# EAGLE design DeadOn RTC - DS3234 Breakout-v11 (EAGLE 6.4)
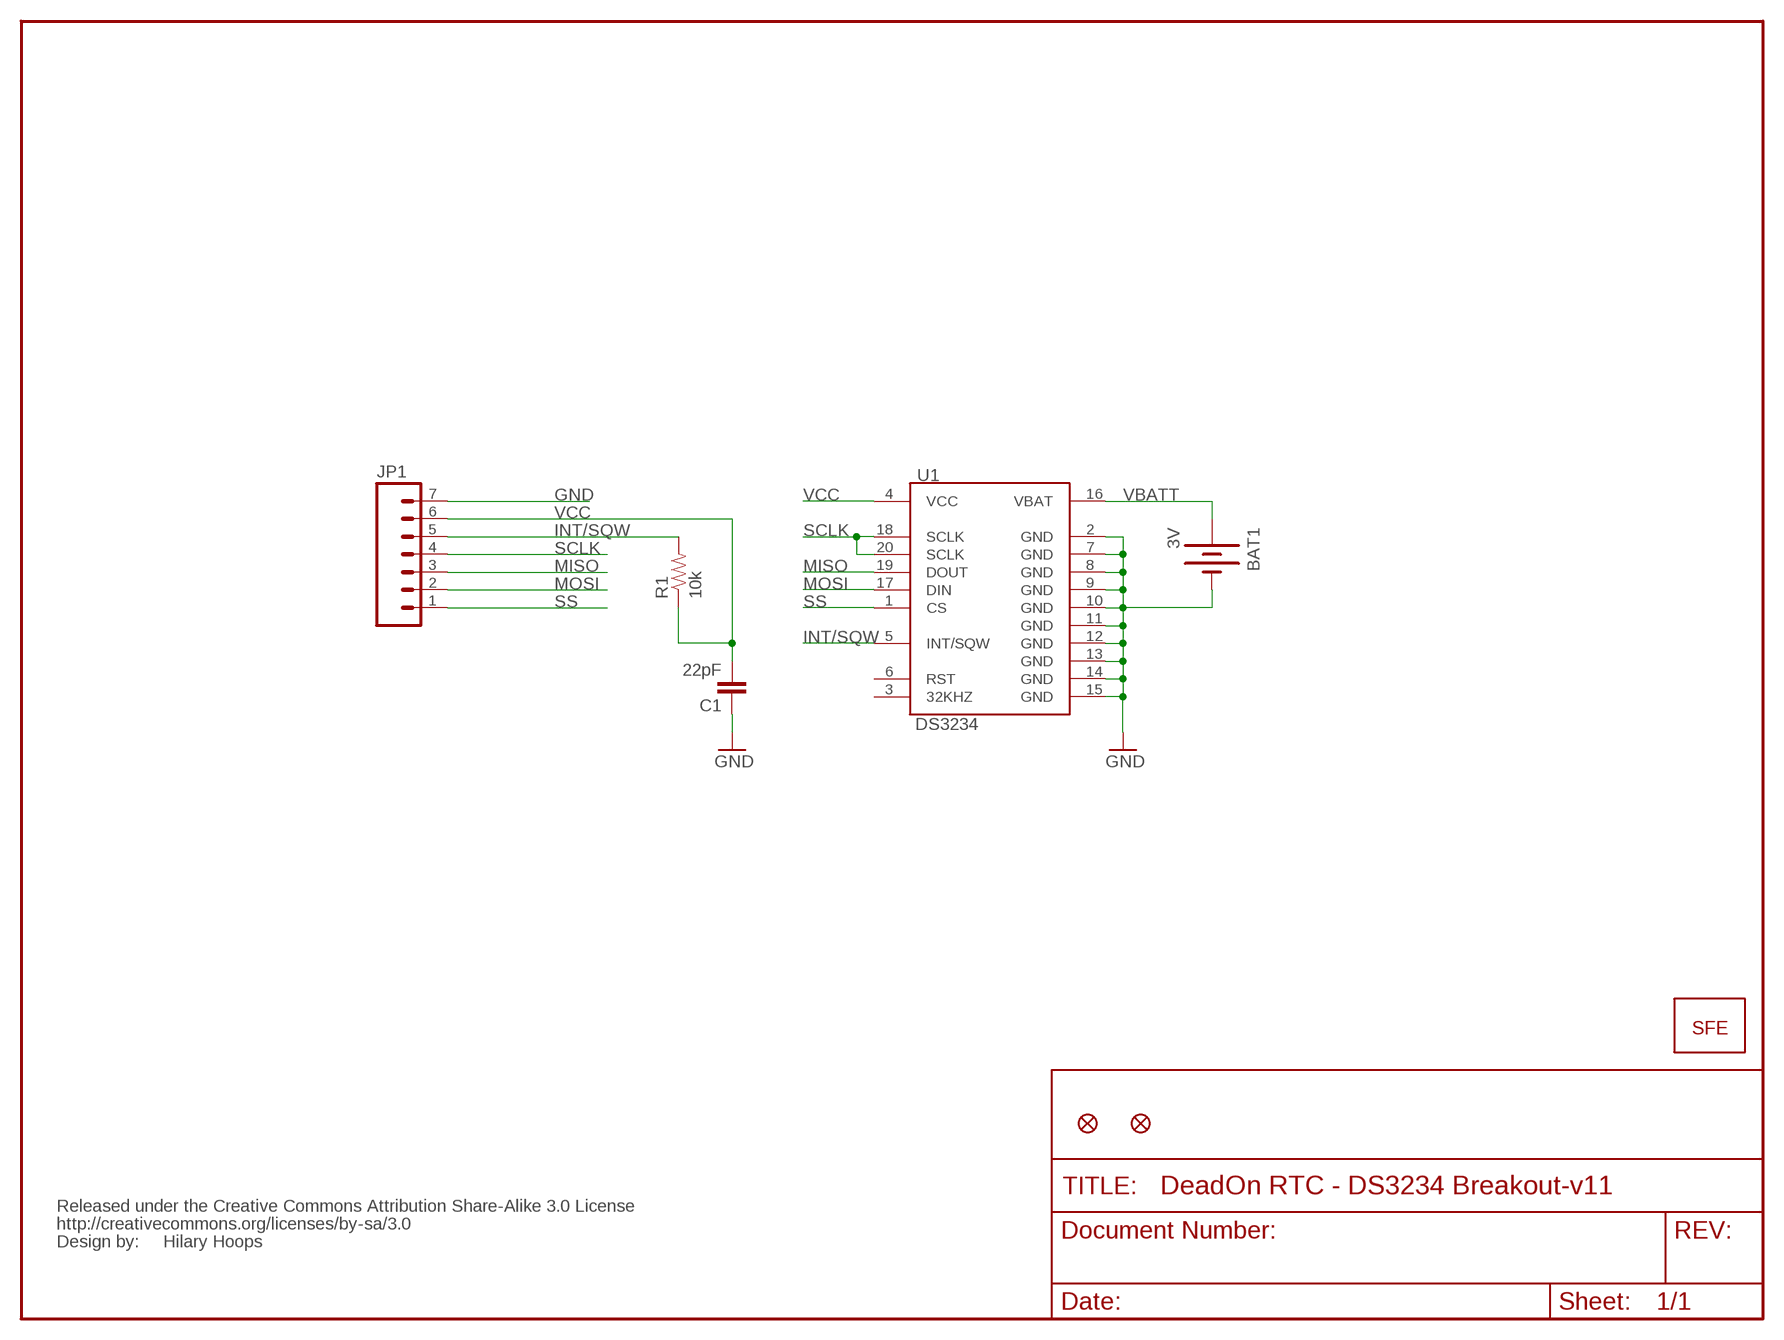
[diagram p0: schematic, sheet 1]

## Parts
BAT1  3V  BATTERY  [BATTCON_12MM_CURVED]
C1  22pF  CAP0402-CAP  [0402-CAP]
JP1  M07  [1X07]
JP2  LOGO-SFESK  [SFE-LOGO-FLAME]
JP3  FIDUCIAL1X2  [FIDUCIAL-1X2]
JP4  FIDUCIAL1X2  [FIDUCIAL-1X2]
R1  10k  RESISTOR0402-RES  [0402-RES]
U1  DS3234  [DS3234]
U$1  CREATIVE_COMMONS  [CREATIVE_COMMONS]

## Nets
GND: BAT1.GND(-) C1.1 JP1.7 U1.2(GND) U1.7(GND) U1.8(GND) U1.9(GND) U1.10(GND) U1.11(GND) U1.12(GND) U1.13(GND) U1.14(GND) U1.15(GND)
INT/SQW: JP1.5 R1.2 U1.5(INT/SQW)
MISO: JP1.3 U1.19(DOUT)
MOSI: JP1.2 U1.17(DIN)
SCLK: JP1.4 U1.18(SCLK) U1.20(SCLK)
SS: JP1.1 U1.1(CS)
VBATT: BAT1.PWR@1(+) U1.16(VBAT)
VCC: C1.2 JP1.6 R1.1 U1.4(VCC)
Unconnected: U1.3(32KHZ) U1.6(RST)

## Notes on the sheet
- Hilary Hoops

## Library data of the parts
BAT1 = SparkFun:BATTERY: Battery Holders Various common sizes : AA, AAA, 20mm coin cell and 12mm coin cell.
C1 = SparkFun:CAP: Capacitor Standard 0603 ceramic capacitor, and 0.1" leaded capacitor.
JP1 = SparkFun:M07: Header 7 Standard 7-pin 0.1" header. Use with straight break away headers (SKU : PRT-00116), right angle break away headers (PRT-00553), swiss pins (PRT-00743), machine pins (PRT-00117), and female headers (PRT-00115). NOTES ON THE VARIANTS LOCK and LOCK_LONGPADS... This footprint was designed to help hold the alignment of a through-hole component (i.e. 7-pin header) while soldering it into place. You may notice that each hole has been shifted either up or down by 0.005 of an inch from it's more standard position (which is usually a perfectly straight line). This slight alteration caused the pins (the squares in the middle) to touch the edges of the holes. Because they are alternating, it causes a "brace" to hold the header in place. 0.005 has proven to be the perfect amount of "off-center" position when using our standard breakaway headers. Although looks a little odd when you look at the bare footprint, once you have a header in there, the alteration is very hard to notice. Also, if you push a header all the way into place, it is covered up entirely on the bottom side. This idea of altering the position of holes to aid alignment will be further integrated into the Sparkfun Library for other footprints. It can help hold any component with 3 or more connection pins.
JP2 = SparkFun:LOGO-SFE: Spark Fun Electronics PCB Logo This is the standard Spark Fun Electronics PCB logo.
JP3 JP4 = SparkFun:FIDUCIAL: Fiducial Alignment Points Various fiducial points for machine vision alignment.
R1 = SparkFun:RESISTOR: Resistor Basic schematic elements and footprints for 0603, 1206, and PTH resistors.
U1 = SparkFun:DS3234: DS3234 Real Time Clock
U$1 = SparkFun:CREATIVE_COMMONS

## Board
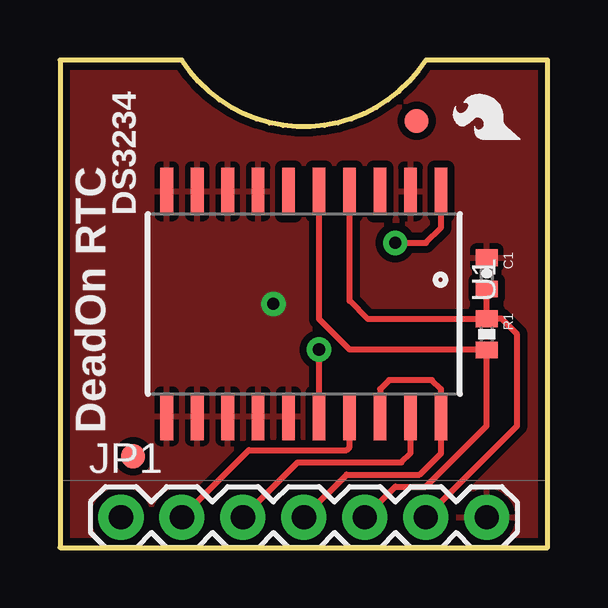
[diagram p1: board, top side]
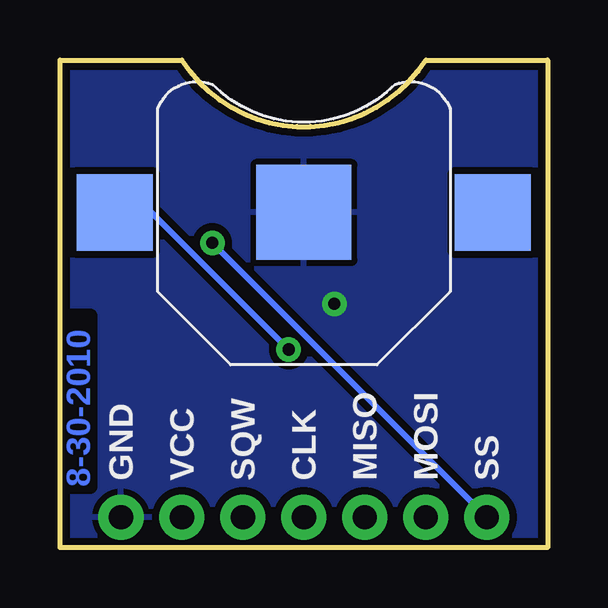
[diagram p2: board, bottom side, seen from below]

Size 20.32 x 20.32 mm. Coordinates in mm from the lower left corner, seen from the top.
Outline: 0,0 20.32,0 20.32,20.32 15.24,20.32 arc-115 5.08,20.32 0,20.32 0,0
Copper layers (1*16): Top 0.035mm / dielectric 1.5mm / Bottom 0.035mm
Design rules "SparkFun": minimum track width 8mil, minimum drill 20mil, track to track 8mil, track to pad 8mil, pad to pad 8mil, via to via 8mil, smd to smd 8mil, copper to edge 8mil, drill to drill 8mil, minimum pad ring 12mil, minimum via ring 10mil, stop-mask expansion 4mil, vias tented up to drill 20mil, thermal gap 10mil

### Footprints (pad centres in the part's own frame; a part is rotated, then mirrored left to right if it is on the bottom)
BATTCON_12MM_CURVED = smd 3.962 x 3.962: GND 0,0 | smd 3.175 x 3.175: PWR@1 -7.874,0; PWR@2 7.874,0
0402-CAP = smd 0.7 x 0.9: 1 -0.65,0; 2 0.65,0
1X07 = drill 1.016 pad 1.88: 1 0,0; 2 2.54,0; 3 5.08,0; 4 7.62,0; 5 10.16,0; 6 12.7,0; 7 15.24,0
FIDUCIAL-1X2 = smd 1 x 1: 1 0,0
0402-RES = smd 0.7 x 0.9: 1 -0.65,0; 2 0.65,0
DS3234 = smd 0.53 x 1.98: 1 -5.715,-4.685; 2 -4.445,-4.685; 3 -3.175,-4.685; 4 -1.905,-4.685; 5 -0.635,-4.685; 6 0.635,-4.685; 7 1.905,-4.685; 8 3.175,-4.685; 9 4.445,-4.685; 10 5.715,-4.685; 11 5.715,4.685; 12 4.445,4.685; 13 3.175,4.685; 14 1.905,4.685; 15 0.635,4.685; 16 -0.635,4.685; 17 -1.905,4.685; 18 -3.175,4.685; 19 -4.445,4.685; 20 -5.715,4.685

### Placement (x,y rotation side)
BAT1  10.16,13.97 0 bottom
C1  17.78,11.43 270 top
JP1  2.54,1.27 0 top
JP2  19.18,17.02 90 top
JP3  3.05,3.81 0 top
JP4  14.86,17.78 0 top
R1  17.78,8.89 270 top
U1  10.16,10.16 180 top
U$1  -17.78,-8.89 0 top  (outside the outline)

### Tracks (layer width: path | path; a pad name or v marks a point on that pad's centre or on a via)
GND  (via drill 0.51)
  other vias: 8.89,10.16
  pour Bottom (isolate 0.305): 0,20.32 0,0 20.32,0 20.32,20.32
  pour Top (isolate 0.305): 0,20.32 20.32,20.32 20.32,0 0,0
INT/SQW
  Top 0.254: JP1.5 13.97,2.54 15.24,2.54 17.78,5.08 R1.2 17.77,8.26 12.06,8.26 10.79,9.53 U1.5
MISO
  Top 0.254: U1.19 14.61,3.94 14.22,3.56 9.91,3.56 JP1.3
MOSI
  Top 0.254: U1.17 12.06,4.19 11.94,4.06 7.87,4.06 JP1.2
SCLK
  Top 0.254: U1.18 13.34,6.6 13.72,6.99 15.49,6.99 15.88,6.6 U1.20 15.88,3.94 14.99,3.05 11.94,3.05 JP1.4
SS  (via drill 0.51)
  Top 0.254: v13.97,12.7 15.24,12.7 15.88,13.34 U1.1
  Bottom 0.254: JP1.1 v13.97,12.7
VBATT  (via drill 0.51)
  Top 0.254: U1.16 v10.79,8.26
  Bottom 0.254: BAT1.PWR@1 16.51,13.97 v10.79,8.26
VCC
  Top 0.254: R1.1 C1.2 | R1.1 18.4,9.54 19.05,8.89 19.05,5.08 JP1.6 | U1.4 12.06,10.29 12.83,9.53 17.77,9.53 R1.1

### Text on the board
Bottom: 8-30-2010
tPlace: DeadOn RTC | DS3234
bPlace: SS | MOSI | MISO | CLK | SQW | VCC | GND
bNames: Hilary Hoops